# Altium schematic sheet AbraSchematicVer5.SchDoc.SchDoc: Title:
size 409 x 282 mm; Date: 2016-02-28 10:10:14 AM; SheetNumber: 1; A: A; B: B; C: C; D: D; E: E; F: F; G: G; H: H; 1: 1; 2: 2; 3: 3; 4: 4; 5: 5; Drawn By:: Drawn By:; Version:: Version:
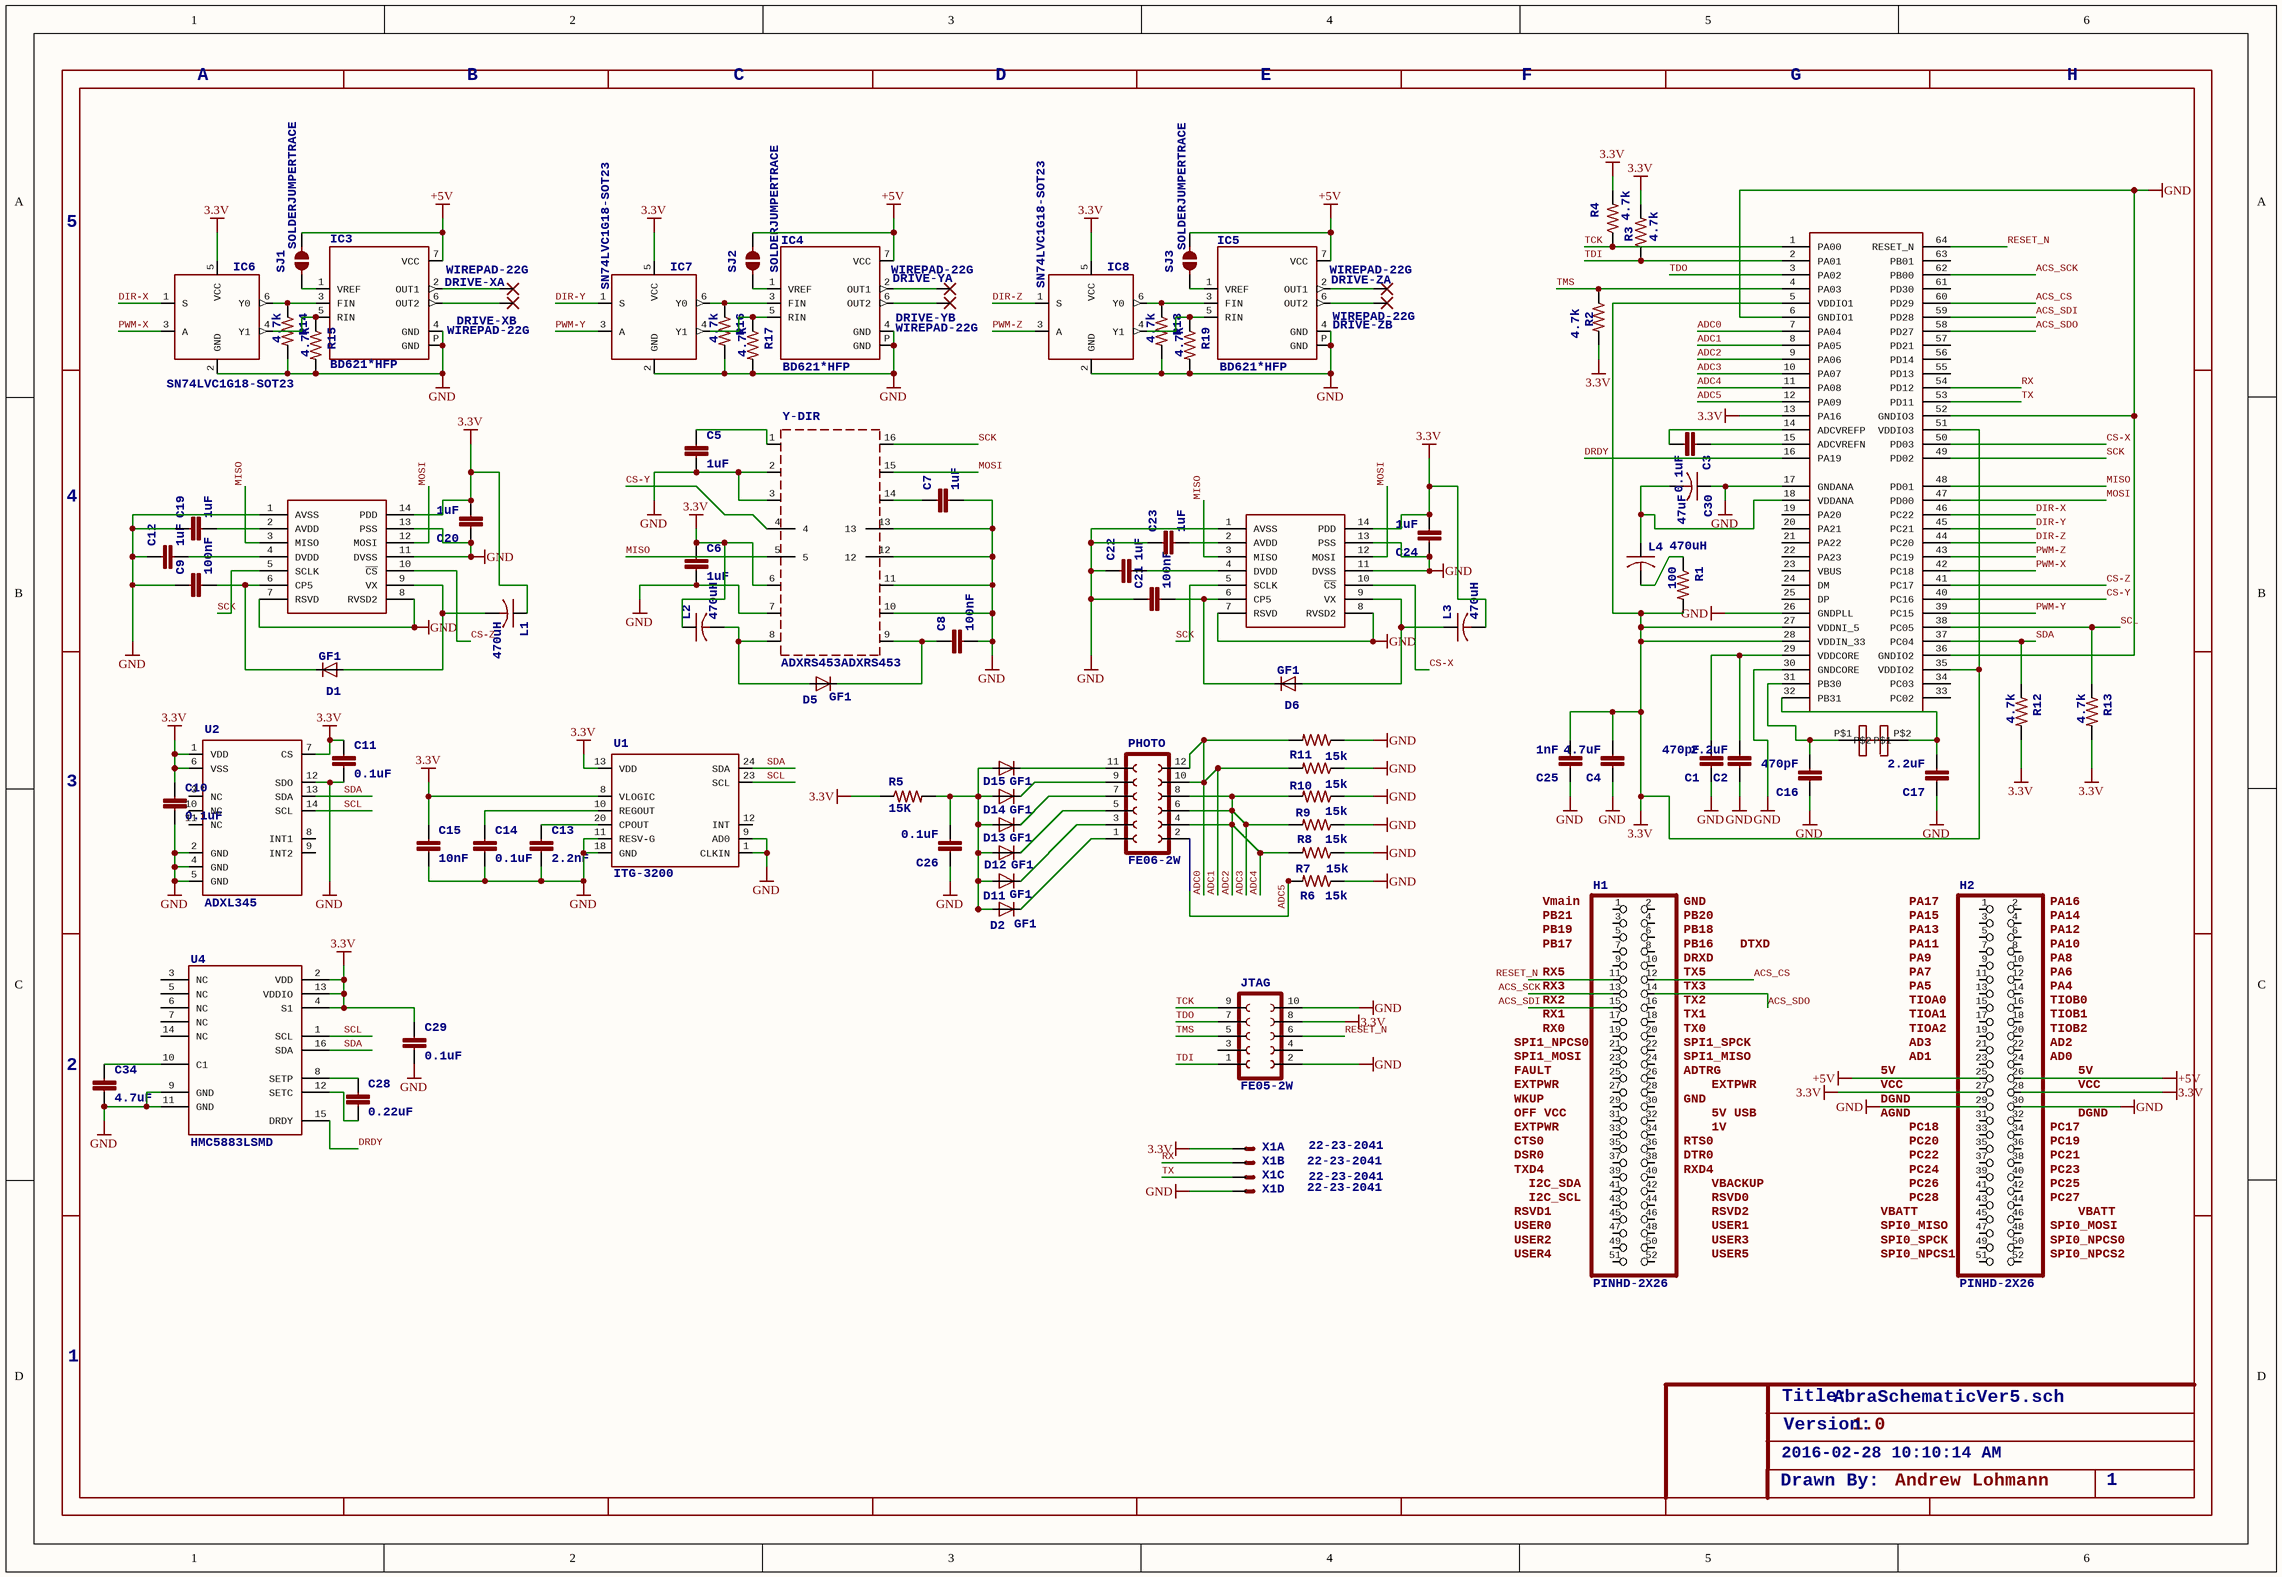
[diagram p0: AbraSchematicVer5.SchDoc.SchDoc]

## Parts
AXDRS453-LCC_X-DIR  ADXRS453-LCC  [ADX-VERT]  (value not drawn)
AXDRS453-LCC_Z-DIR  ADXRS453-LCC  [ADX-VERT]  (value not drawn)
C1  470pF  [0603-CAP]
C2  2.2uF  [0603-CAP]
C3  0.1uF  [0603-CAP]
C4  4.7uF  [0603-CAP]
C5  1uF  [0603-CAP]
C6  1uF  [0603-CAP]
C7  1uF  [0603-CAP]
C8  100nF  [0603-CAP]
C9  100nF  [0603-CAP]
C10  0.1uF  [0603-CAP]
C11  0.1uF  [0603-CAP]
C12  1uF  [0603-CAP]
C13  2.2nF  [0603-CAP]
C14  0.1uF  [0603-CAP]
C15  10nF  [0603-CAP]
C16  470pF  [0603-CAP]
C17  2.2uF  [0603-CAP]
C19  1uF  [0603-CAP]
C20  1uF  [0603-CAP]
C21  100nF  [0603-CAP]
C22  1uF  [0603-CAP]
C23  1uF  [0603-CAP]
C24  1uF  [0603-CAP]
C25  1nF  [0603-CAP]
C26  0.1uF  [0603-CAP]
C28  0.22uF  [0603-CAP]
C29  0.1uF  [0603-CAP]
C30  47uF  [C1210K]
C34  4.7uF  [0603-CAP]
CRYSTAL  CRYSTAL-CAP  [CSM-3X_SMD]  (value not drawn)
D1  GF1  [SMA-DO214AC]
D2  GF1  [SMA-DO214AC]
D5  GF1  [SMA-DO214AC]
D6  GF1  [SMA-DO214AC]
D11  GF1  [SMA-DO214AC]
D12  GF1  [SMA-DO214AC]
D13  GF1  [SMA-DO214AC]
D14  GF1  [SMA-DO214AC]
D15  GF1  [SMA-DO214AC]
DRIVE-XA  WIREPAD-22G  [PAD-22G]
DRIVE-XB  WIREPAD-22G  [PAD-22G]
DRIVE-YA  WIREPAD-22G  [PAD-22G]
DRIVE-YB  WIREPAD-22G  [PAD-22G]
DRIVE-ZA  WIREPAD-22G  [PAD-22G]
DRIVE-ZB  WIREPAD-22G  [PAD-22G]
H1  PINHD-2X26  [HEADER-2X26]
H2  PINHD-2X26  [HEADER-2X26]
IC3  BD621*HFP  [HRP7]
IC4  BD621*HFP  [HRP7]
IC5  BD621*HFP  [HRP7]
IC6  SN74LVC1G18-SOT23  [SOT23-6]
IC7  SN74LVC1G18-SOT23  [SOT23-6]
IC8  SN74LVC1G18-SOT23  [SOT23-6]
JTAG  FE05-2W  [FE05-2W]
L1  470uH  [C1210K]
L2  470uH  [C1210K]
L3  470uH  [C1210K]
L4  470uH  [C1210K]
PHOTO  FE06-2W  [FE06-2W]
R1  100  [0603-RES]
R2  4.7k  [0603-RES]
R3  4.7k  [0603-RES]
R4  4.7k  [0603-RES]
R5  15K  [0603-RES]
R6  15k  [0603-RES]
R7  15k  [0603-RES]
R8  15k  [0603-RES]
R9  15k  [0603-RES]
R10  15k  [0603-RES]
R11  15k  [0603-RES]
R12  4.7k  [0603-RES]
R13  4.7k  [0603-RES]
R14  4.7k  [0603-RES]
R15  4.7k  [0603-RES]
R16  4.7k  [0603-RES]
R17  4.7k  [0603-RES]
R18  4.7k  [0603-RES]
R19  4.7k  [0603-RES]
SJ1  SOLDERJUMPERTRACE  [SJ_2S-TRACE]
SJ2  SOLDERJUMPERTRACE  [SJ_2S-TRACE]
SJ3  SOLDERJUMPERTRACE  [SJ_2S-TRACE]
U1  ITG-3200  [QFN-24]
U2  ADXL345  [LGA14]
U4  HMC5883LSMD  [16LPCC]
U$1  AT32UC3C-LEAD2  [TQFP64-CORRECT]  (value not drawn)
X1  22-23-2041  [22-23-2041]  (parts A,B,C,D of 4)
Y-DIR  ADXRS453ADXRS453  [N5]

## Nets
3.3V: AXDRS453-LCC_X-DIR.14(PDD) AXDRS453-LCC_Z-DIR.14(PDD) C4.2 C6.1 C10.1 C11.1 C15.1 C20.2 C24.2 C25.2 C29.1 H2.27 H2.28 IC6.5(VCC) IC7.5(VCC) IC8.5(VCC) JTAG.8 L1.1 L2.1 L3.2 R1.2 R2.2 R3.2 R4.2 R5.1 R12.2 R13.2 U1.8(VLOGIC) U1.13(VDD) U2.1(VDD) U2.6(VSS) U2.7(CS) U4.2(VDD) U4.4(S1) U4.13(VDDIO) U$1.5(VDDIO1) U$1.13(PA16) U$1.27(VDDNI_5) U$1.28(VDDIN_33) U$1.35(VDDIO2) U$1.51(VDDIO3) X1.1(S) Y-DIR.6
+5V: H2.25 H2.26 IC3.7(VCC) IC4.7(VCC) IC5.7(VCC) SJ1.2 SJ2.2 SJ3.2
GND: AXDRS453-LCC_X-DIR.1(AVSS) AXDRS453-LCC_X-DIR.7(RSVD) AXDRS453-LCC_X-DIR.8(RVSD2) AXDRS453-LCC_X-DIR.11(DVSS) AXDRS453-LCC_X-DIR.13(PSS) AXDRS453-LCC_Z-DIR.1(AVSS) AXDRS453-LCC_Z-DIR.7(RSVD) AXDRS453-LCC_Z-DIR.8(RVSD2) AXDRS453-LCC_Z-DIR.11(DVSS) AXDRS453-LCC_Z-DIR.13(PSS) C1.1 C2.1 C4.1 C5.2 C6.2 C7.2 C8.2 C9.1 C10.2 C11.2 C12.1 C13.2 C14.2 C15.2 C16.1 C17.1 C19.1 C20.1 C21.1 C22.1 C23.1 C24.1 C25.1 C26.1 C29.2 C30.1 C34.2 H2.29 H2.30 IC3.4(GND) IC3.P(GND) IC4.4(GND) IC4.P(GND) IC5.4(GND) IC5.P(GND) IC6.2(GND) IC7.2(GND) IC8.2(GND) JTAG.2 JTAG.10 R6.1 R7.1 R8.1 R9.1 R10.1 R11.1 R14.2 R15.2 R16.2 R17.2 R18.2 R19.2 U1.1(CLKIN) U1.9(AD0) U1.11(RESV-G) U1.18(GND) U2.2(GND) U2.4(GND) U2.5(GND) U2.12(SDO) U4.9(GND) U4.11(GND) U$1.6(GNDIO1) U$1.17(GNDANA) U$1.26(GNDPLL) U$1.30(GNDCORE) U$1.36(GNDIO2) U$1.52(GNDIO3) X1.4(S) Y-DIR.2 Y-DIR.3 Y-DIR.7 Y-DIR.10 Y-DIR.11 Y-DIR.12 Y-DIR.13
ACS_CS: H1.12 U$1.60(PD29)
ACS_SCK: U$1.62(PB00)
ACS_SDI: U$1.59(PD28)
ACS_SDO: H1.14 U$1.58(PD27)
ADC0: PHOTO.10 PHOTO.12 R10.2 R11.2 U$1.7(PA04) U$1.8(PA05)  [also labelled ADC1]
ADC2: PHOTO.4 PHOTO.6 PHOTO.8 R7.2 R8.2 R9.2 U$1.9(PA06) U$1.10(PA07) U$1.11(PA08)  [also labelled ADC3, ADC4]
ADC5: PHOTO.2 R6.2 U$1.12(PA09)
CS-X: AXDRS453-LCC_X-DIR.10(~{CS}) U$1.50(PD03)
CS-Y: U$1.40(PC16) Y-DIR.4
CS-Z: AXDRS453-LCC_Z-DIR.10(~{CS}) U$1.41(PC17)
DIR-X: IC6.1(S) U$1.46(PC22)
DIR-Y: IC7.1(S) U$1.45(PC21)
DIR-Z: IC8.1(S) U$1.44(PC20)
DRDY: U4.15(DRDY) U$1.16(PA19)
MISO: AXDRS453-LCC_X-DIR.3(MISO) AXDRS453-LCC_Z-DIR.3(MISO) U$1.48(PD01) Y-DIR.5
MOSI: AXDRS453-LCC_X-DIR.12(MOSI) AXDRS453-LCC_Z-DIR.12(MOSI) U$1.47(PD00) Y-DIR.15
PWM-X: IC6.3(A) U$1.42(PC18)
PWM-Y: IC7.3(A) U$1.39(PC15)
PWM-Z: IC8.3(A) U$1.43(PC19)
RESET_N: JTAG.6 U$1.64(RESET_N)
RX: U$1.54(PD12) X1.2(S)
SCK: AXDRS453-LCC_X-DIR.5(SCLK) AXDRS453-LCC_Z-DIR.5(SCLK) U$1.49(PD02) Y-DIR.16
SCL: R13.1 U1.23(SCL) U2.14(SCL) U4.1(SCL) U$1.38(PC05)
SDA: R12.1 U1.24(SDA) U2.13(SDA) U4.16(SDA) U$1.37(PC04)
TCK: JTAG.9 R4.1 U$1.1(PA00)
TDI: JTAG.1 R3.1 U$1.2(PA01)
TDO: JTAG.7 U$1.3(PA02)
TMS: JTAG.5 R2.1 U$1.4(PA03)
TX: U$1.53(PD11) X1.3(S)
NetAXDRS453-LCC_X-DIR_2: AXDRS453-LCC_X-DIR.2(AVDD) C23.2
NetAXDRS453-LCC_X-DIR_4: AXDRS453-LCC_X-DIR.4(DVDD) C22.2
NetAXDRS453-LCC_X-DIR_6: AXDRS453-LCC_X-DIR.6(CP5) C21.2 D6.K(C)
NetAXDRS453-LCC_X-DIR_9: AXDRS453-LCC_X-DIR.9(VX) D6.A L3.1
NetAXDRS453-LCC_Z-DIR_2: AXDRS453-LCC_Z-DIR.2(AVDD) C19.2
NetAXDRS453-LCC_Z-DIR_4: AXDRS453-LCC_Z-DIR.4(DVDD) C12.2
NetAXDRS453-LCC_Z-DIR_6: AXDRS453-LCC_Z-DIR.6(CP5) C9.2 D1.K(C)
NetAXDRS453-LCC_Z-DIR_9: AXDRS453-LCC_Z-DIR.9(VX) D1.A L1.2
NetC1_2: C1.2 C2.2 U$1.29(VDDCORE)
NetC3_1: C3.1 U$1.15(ADCVREFN)
NetC3_2: C3.2 U$1.14(ADCVREFP)
NetC5_1: C5.1 Y-DIR.1
NetC7_1: C7.1 Y-DIR.14
NetC8_1: C8.1 D5.K(C) Y-DIR.9
NetC13_1: C13.1 U1.20(CPOUT)
NetC14_1: C14.1 U1.10(REGOUT)
NetC16_2: C16.2 CRYSTAL.P$1 U$1.31(PB30)
NetC17_2: C17.2 CRYSTAL.P$2 U$1.32(PB31)
NetC26_2: C26.2 D2.A D11.A D12.A D13.A D14.A D15.A R5.2
NetC28_1: C28.1 U4.8(SETP)
NetC28_2: C28.2 U4.12(SETC)
NetC30_2: C30.2 L4.1 U$1.18(VDDANA)
NetC34_1: C34.1 U4.10(C1)
NetD2_K: D2.K(C) PHOTO.1
NetD5_A: D5.A L2.2 Y-DIR.8
NetD11_K: D11.K(C) PHOTO.3
NetD12_K: D12.K(C) PHOTO.5
NetD13_K: D13.K(C) PHOTO.7
NetD14_K: D14.K(C) PHOTO.9
NetD15_K: D15.K(C) PHOTO.11
NetDRIVE-XA_1: DRIVE-XA.1(P) IC3.2(OUT1)
NetDRIVE-XB_1: DRIVE-XB.1(P) IC3.6(OUT2)
NetDRIVE-YA_1: DRIVE-YA.1(P) IC4.2(OUT1)
NetDRIVE-YB_1: DRIVE-YB.1(P) IC4.6(OUT2)
NetDRIVE-ZA_1: DRIVE-ZA.1(P) IC5.2(OUT1)
NetDRIVE-ZB_1: DRIVE-ZB.1(P) IC5.6(OUT2)
NetIC3_1: IC3.1(VREF) SJ1.1
NetIC3_3: IC3.3(FIN) IC6.6(Y0) R14.1
NetIC3_5: IC3.5(RIN) IC6.4(Y1) R15.1
NetIC4_1: IC4.1(VREF) SJ2.1
NetIC4_3: IC4.3(FIN) IC7.6(Y0) R16.1
NetIC4_5: IC4.5(RIN) IC7.4(Y1) R17.1
NetIC5_1: IC5.1(VREF) SJ3.1
NetIC5_3: IC5.3(FIN) IC8.6(Y0) R18.1
NetIC5_5: IC5.5(RIN) IC8.4(Y1) R19.1
NetL4_2: L4.2 R1.1

Not connected (* = marked no-connect by the designer): H1 1 2 3 4 5 6 7 8 9 10 11 13 15 16 17 18 19 20 21 22 23 24 25 26 27 28 29 30 31 32 33 34 35 36 37 38 39 40 41 42 43 44 45 46 47 48 49 50 51 52; H2 1 2 3 4 5 6 7 8 9 10 11 12 13 14 15 16 17 18 19 20 21 22 23 24 31 32 33 34 35 36 37 38 39 40 41 42 43 44 45 46 47 48 49 50 51 52; JTAG 3 4; U1 12(INT); U2 3(NC) 8(INT1) 9(INT2) 10(NC) 11(NC); U4 3(NC) 5(NC) 6(NC) 7(NC) 14(NC); U$1 19(PA20) 20(PA21) 21(PA22) 22(PA23) 23(VBUS) 24(DM) 25(DP) 33(PC02) 34(PC03) 55(PD13) 56(PD14) 57(PD21) 61(PD30) 63(PB01)

## Notes on the sheet
- (near H1) Vmain
- PB21
- PB19
- PB17
- (near H1) GND
- (near H1) PB20
- (near H1) PB18
- (near H1) PB16
- (near H1) DRXD
- DTXD
- PA17
- PA15
- PA13
- PA11
- PA9
- (near H2) PA16
- (near H2) PA14
- (near H2) PA12
- (near H2) PA10
- (near H2) PA8
- RX5
- RX3
- RX2
- RX1
- RX0
- (near H1) TX5
- (near H1) TX3
- (near H1) TX2
- (near H1) TX1
- (near H1) TX0
- PA7
- PA5
- (near H2) TIOA0
- (near H2) TIOA1
- (near H2) TIOA2
- (near H2) PA6
- (near H2) PA4
- (near H2) TIOB0
- (near H2) TIOB1
- (near H2) TIOB2
- (near H1) SPI1_NPCS0
- (near H1) SPI1_MOSI
- FAULT
- EXTPWR
- WKUP
- (near H1) SPI1_SPCK
- (near H1) SPI1_MISO
- (near H1) ADTRG
- 5V
- VCC
- DGND
- AD3
- AD1
- (near H2) AD2
- (near H2) AD0
- OFF VCC
- CTS0
- DSR0
- TXD4
- (near H1) RTS0
- (near H1) DTR0
- (near H1) RXD4
- 5V USB
- 1V
- AGND
- PC18
- PC20
- PC22
- PC24
- (near H2) PC17
- (near H2) PC19
- (near H2) PC21
- (near H2) PC23
- RSVD1
- USER0
- USER2
- (near H1) I2C_SDA
- (near H1) I2C_SCL
- VBACKUP
- RSVD0
- RSVD2
- USER1
- USER3
- VBATT
- (near H2) SPI0_MISO
- (near H2) SPI0_SPCK
- PC26
- PC28
- (near H2) PC25
- (near H2) PC27
- (near H2) SPI0_MOSI
- (near H2) SPI0_NPCS0
- USER4
- USER5
- (near H2) SPI0_NPCS1
- (near H2) SPI0_NPCS2
- 1.0
- Andrew Lohmann
- Labels drawn without touching a wire or pin: ACS_SCK, ACS_SDI, RESET_N

## Library data of the parts
C1-C17 C19-C26 C28 C29 C34 = CAPACITOR-0603: <b>Capacitor</b> / Standard SMT, and 0.1", and 0.2" leaded ceramic capacitors
C30 L1-L4 = C-USC1210K: <B>CAPACITOR</B>, American symbol
D1 D2 D5 D6 D11-D15 = GF1: <B>DIODE</B>
DRIVE-XA DRIVE-XB DRIVE-YA DRIVE-YB DRIVE-ZA DRIVE-ZB = WIREPAD-22G: <b>THROUGH-HOLE PAD</b>
H1 H2 = PINHD-2X26: <b>PIN HEADER</b>
IC3-IC5 = BD621*HFP: <b>H-bridge driver</b> for brush motors / <p>BD621* have minimum 3V power input, BD62*2 have 2A current rating</p> / Source: http://www.rohm.com/products/databook/motor/pdf/bd623x_series-e.pdf; MPN: BD6232HFP-TR; OC_FARNELL: 1712947; OC_NEWARK: 24R5627
IC6-IC8 = SN74LVC1G18-SOT23: <b>1-of-2 Noninverting Demultiplexer with 3-state Deselected Output</b> / <p>Function-Compatible with SN74AUC1G19 Decoder/Demultiplexer (for High Deselected Output)<p>
JTAG = FE05-2W: <b>FEMALE HEADER</b>; OC_FARNELL: unknown; OC_NEWARK: unknown
PHOTO = FE06-2W: <b>FEMALE HEADER</b>; OC_FARNELL: unknown; OC_NEWARK: unknown
R1-R19 = RESISTOR-0603: <p><b>Resistor</b></p> / Basic schematic elements and footprints for resistors.
SJ1-SJ3 = SOLDERJUMPERTRACE: <b>Solder Jumper</b> / Standard SMD solder jumper. Used to automate production. Two varients : Normally Open and Normally Closed are the same, but have different paste layers. NC will have a large amount of paste and should jumper during reflow.
U1 = ITG-3200: ITG-3200 3-axis gyro, digital output, qfn24 package
U4 = HMC5883LSMD: 3 Axis Digital Compass IC
X1 = 22-23-2041: .100" (2.54mm) Center Header - 4 Pin; MF: MOLEX; MPN: 22-23-2041; OC_FARNELL: 1462920; OC_NEWARK: 38C0355
Y-DIR = ADXRS453ADXRS453: Angular Rate Sensor.